# EAGLE design Controller (EAGLE 9.6.2)
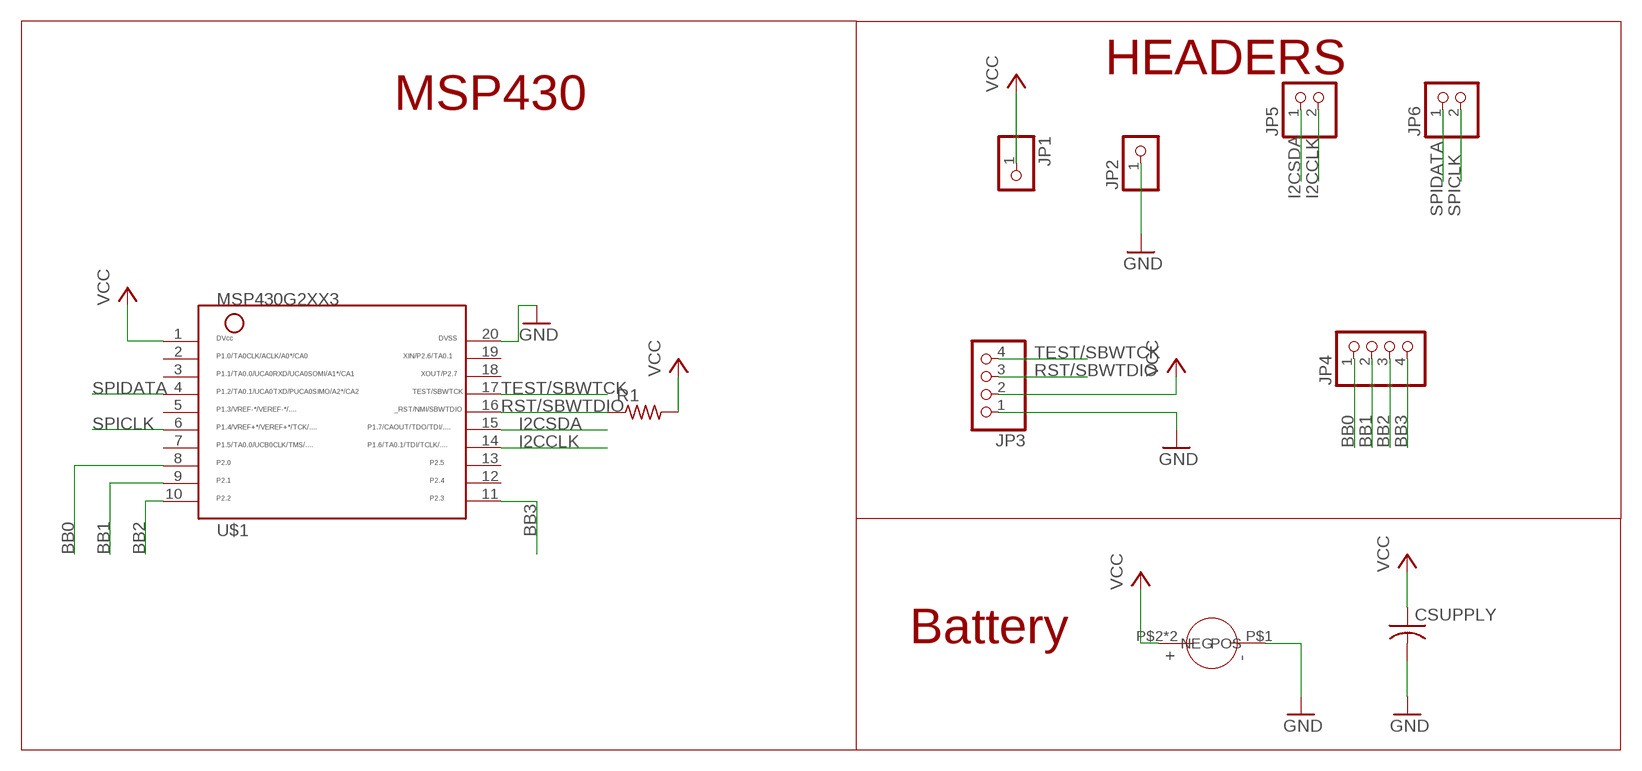
[diagram p0: schematic, sheet 1]

## Parts
CSUPPLY  C-USC1206  [C1206]
JP1  PINHD-1X1  [1X01]
JP2  PINHD-1X1  [1X01]
JP3  PINHD-1X4  [1X04]
JP4  PINHD-1X4  [1X04]
JP5  PINHD-1X2  [1X02]
JP6  PINHD-1X2  [1X02]
R1  R-US_R1206  [R1206]
U$1  MSP430G2XX3TSSOP  [PW20]
U$2  3002BATTERY  [3002BATTERY]

## Nets
BB0: JP4.1 U$1.8
BB1: JP4.2 U$1.9
BB2: JP4.3 U$1.10
BB3: JP4.4 U$1.11
GND: CSUPPLY.2 JP2.1 JP3.1 U$1.20 U$2.P$1(NEG)
I2CCLK: JP5.2 U$1.14
I2CSDA: JP5.1 U$1.15
RST/SBWTDIO: JP3.3 R1.1 U$1.16
SPICLK: JP6.2 U$1.6
SPIDATA: JP6.1 U$1.4
TEST/SBWTCK: JP3.4 U$1.17
VCC: CSUPPLY.1 JP1.1 JP3.2 R1.2 U$1.1 U$2.P$2(POS) U$2.P$3(POS)
Unconnected: U$1.2 U$1.3 U$1.5 U$1.7 U$1.12 U$1.13 U$1.18 U$1.19

## Notes on the sheet
- HEADERS
- MSP430
- Battery

## Library data of the parts
CSUPPLY = rcl:C-US: CAPACITOR, American symbol; SPICEPREFIX: C
JP1 JP2 = pinhead:PINHD-1X1: PIN HEADER
JP3 JP4 = pinhead:PINHD-1X4: PIN HEADER
JP5 JP6 = pinhead:PINHD-1X2: PIN HEADER
R1 = rcl:R-US_: RESISTOR, American symbol; SPICEPREFIX: R
U$1 = givenELEC327:MSP430G2XX3: MSP430G2XX3 PDIP (N) 20 Pin Package
U$2 = Personal:3002BATTERY: 3002 Battery Holder Digikey <https://www.digikey.com/en/products/detail/keystone-electronics/3002/227444> Drawing <https://www.digikey.com/htmldatasheets/production/846798/0/0/1/3002-drawing.html>

## Board
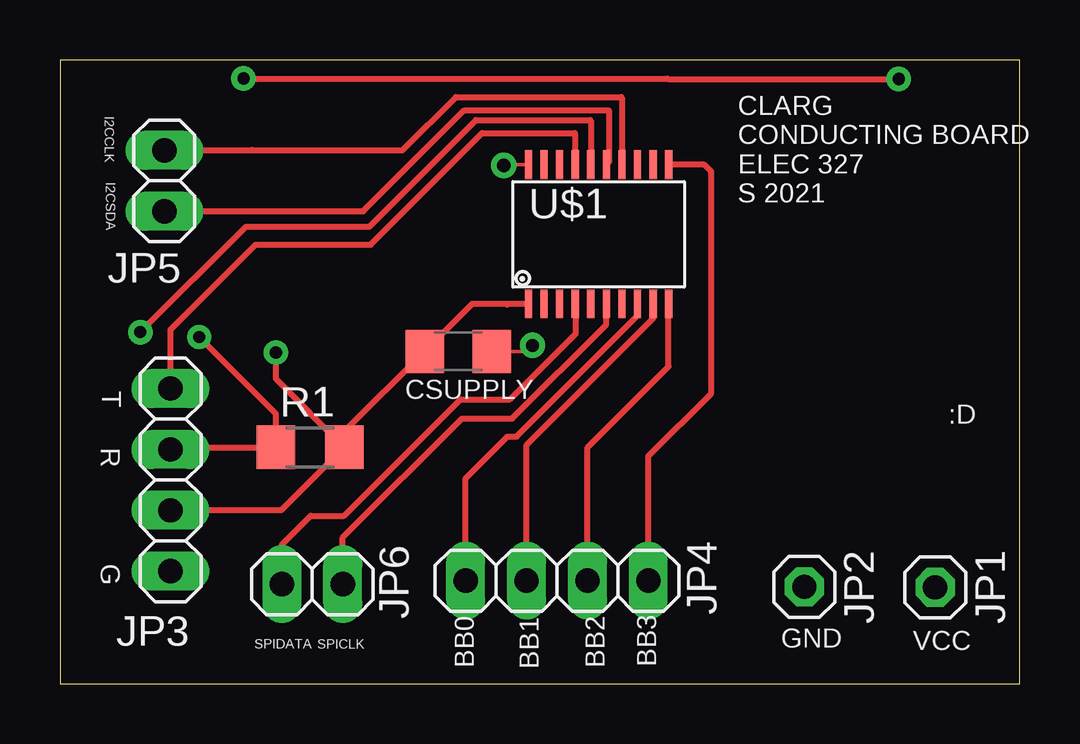
[diagram p1: board, top side]
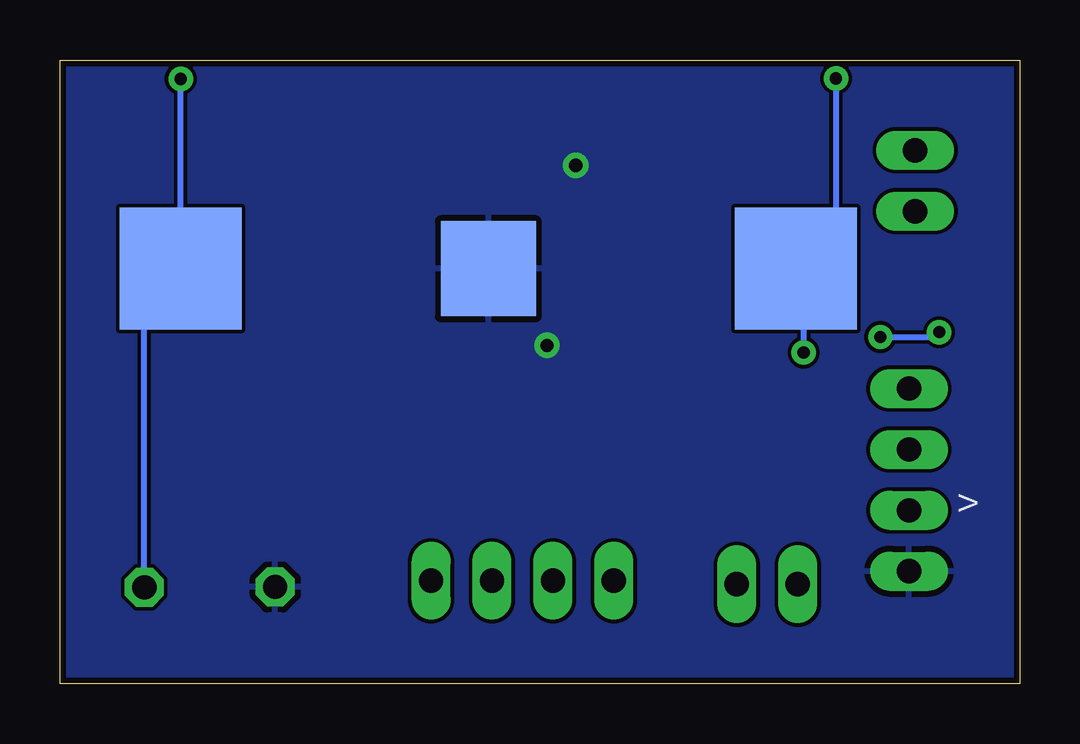
[diagram p2: board, bottom side, seen from below]

Size 40 x 26 mm. Coordinates in mm from the lower left corner, seen from the top.
Outline: 0,0 40,0 40,26 0,26 0,0
Copper layers (1*16): Top 0.035mm / dielectric 1.5mm / Bottom 0.035mm
Design rules "AdvancedCircuitsBarebones": minimum track width 6mil, minimum drill 20mil, track to track 6mil, track to pad 6mil, pad to pad 6mil, via to via 6mil, smd to smd 6mil, copper to edge 10mil, drill to drill 6mil, minimum pad ring 12mil, minimum via ring 10mil, stop-mask expansion 4mil, vias tented up to drill 25mil, thermal gap 10mil

### Footprints (pad centres in the part's own frame; a part is rotated, then mirrored left to right if it is on the bottom)
C1206 = smd 1.6 x 1.8: 1 -1.4,0; 2 1.4,0
1X01 = drill 1.016 octagon: 1 0,0
1X04 = drill 1.016 long: 1 -3.81,0; 2 -1.27,0; 3 1.27,0; 4 3.81,0
1X02 = drill 1.016 long: 1 -1.27,0; 2 1.27,0
R1206 = smd 1.6 x 1.803: 1 -1.422,0; 2 1.422,0
PW20 = smd 0.3 x 1.2: 1 -2.925,-2.9; 2 -2.275,-2.9; 3 -1.625,-2.9; 4 -0.975,-2.9; 5 -0.325,-2.9; 6 0.325,-2.9; 7 0.975,-2.9; 8 1.625,-2.9; 9 2.275,-2.9; 10 2.925,-2.9; 11 2.925,2.9; 12 2.275,2.9; 13 1.625,2.9; 14 0.975,2.9; 15 0.325,2.9; 16 -0.325,2.9; 17 -0.975,2.9; 18 -1.625,2.9; 19 -2.275,2.9; 20 -2.925,2.9
3002BATTERY = smd 3.96 x 3.96: P$1 0,0 | smd 5.08 x 5.08: P$2 12.825,0; P$3 -12.825,0

### Placement (x,y rotation side)
CSUPPLY  16.6,13.85 0 top
JP1  36.48,4.01 0 top
JP2  31.03,4.03 0 top
JP3  4.61,8.49 90 top
JP4  20.72,4.29 0 top
JP5  4.35,20.96 90 top
JP6  10.52,4.14 0 top
R1  10.43,9.85 0 top
U$1  22.45,18.73 0 top
U$2  22.14,17.3 0 bottom

### Tracks (layer width: path | path; a pad name or v marks a point on that pad's centre or on a via)
BB0
  Top 0.254: JP4.1 16.91,8.56 18.65,10.3 19.04,10.3 24.07,15.34 U$1.8
BB1
  Top 0.254: JP4.2 19.45,9.95 24.73,15.22 U$1.9
BB2
  Top 0.254: JP4.3 21.99,9.84 25.38,13.22 U$1.10
BB3
  Top 0.254: JP4.4 24.53,9.48 27.15,12.1 27.15,21.35 26.87,21.63 U$1.11
GND  (via drill 0.55)
  Top 0.152: U$1.20 18.53,21.63 v18.5,21.6 | CSUPPLY.2 19.45,13.85 v19.7,14.1
  pour Bottom: -0.1,0.05 -0.1,26.35 0,26.45 40.35,26.45 41.2,25.6 41.2,0.5 40.75,0.05
I2CCLK
  Top 0.254: JP5.2 7.95,22.23 8.05,22.23 14.28,22.23 16.5,24.45 23.4,24.45 23.43,24.43 U$1.14
I2CSDA
  Top 0.254: U$1.15 22.88,21.73 22.88,23.9 16.85,23.9 12.64,19.69 JP5.1
RST/SBWTDIO  (via drill 0.51)
  Top 0.254: JP3.3 4.7,9.85 R1.1 | R1.1 9.5,10.34 | R1.1 9.01,11.24 v5.8,14.45 | v3.35,14.65 7.75,19.05 12.9,19.05 17.34,23.49 22.1,23.49 22.12,23.47 U$1.16
  Bottom 0.254: v5.8,14.45 3.55,14.45 v3.35,14.65
SPICLK
  Top 0.254: JP6.2 11.79,6.09 16.75,11.05 18.85,11.05 22.77,14.97 U$1.6
SPIDATA
  Top 0.254: JP6.1 9.25,5.8 10.45,7 11.85,7 16.7,11.85 18.75,11.85 21.5,14.6 21.5,15.8 U$1.4
TEST/SBWTCK
  Top 0.254: U$1.17 21.48,22.15 21.48,22.32 21.48,22.93 21.45,22.95 17.6,22.95 12.95,18.3 8.15,18.3 4.61,14.76 JP3.4
VCC  (via drill 0.51)
  Top 0.254: U$1.1 18.68,15.83 | 18.68,15.83 18.65,15.8 | 18.68,15.83 17.18,15.83 CSUPPLY.1 11.85,10.5 R1.2 | R1.2 9.22,7.22 JP3.2 | 7.67,25.21 v7.65,25.23 25.32,25.23 25.34,25.21 v34.97,25.21 | v9,13.8 9,12.7 R1.2
  Bottom 0.152: 32.56,19.7 U$2.P$3
  Bottom 0.254: JP1.1 36.48,15.79 U$2.P$3 v34.97,25.21 | v7.65,25.23 7.65,18.96 U$2.P$2 9.31,16.2 | 9.31,14.98 9.31,16.2 | v9,13.8 9,15.88 9.31,16.2

### Text on the board
tPlace: I2CCLK | I2CSDA | CLARG / CONDUCTING BOARD / ELEC 327 / S 2021 | T | :D | R | G | SPICLK | GND | SPIDATA | BB0 | BB1 | BB2 | BB3 | VCC
bPlace: V